# EAGLE schematic ThermocoupleBreakoutBoard (EAGLE 8.0.1)
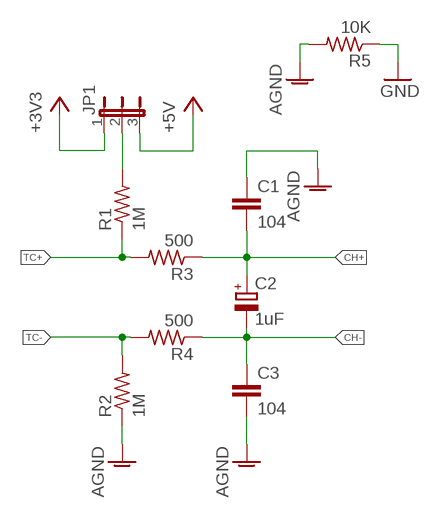
[diagram p0: schematic, sheet 1]

## Parts
C1  104  C-EUC1206  [C1206]
C2  1uF  CPOL-EUE2.5-6  [E2,5-6]
C3  104  C-EUC1206  [C1206]
JP1  JP2E  [JP2]
R1  1M  R-US_M1206  [M1206]
R2  1M  R-US_M1206  [M1206]
R3  500  R-US_M1206  [M1206]
R4  500  R-US_M1206  [M1206]
R5  10K  R-US_M1206  [M1206]

## Nets
+3V3: JP1.1
+5V: JP1.3
AGND: C1.1 C3.2 R2.1 R5.2
CH+: C1.2 C2.+ R3.1
CH-: C2.- C3.1 R4.1
GND: R5.1
N$5: JP1.2 R1.2
TC+: R1.1 R3.2
TC-: R2.2 R4.2

## Library data of the parts
C1 C3 = rcl_vm:C-EU: CAPACITOR, European symbol
C2 = rcl_vm:CPOL-EU: POLARIZED CAPACITOR, European symbol
JP1 = jumper_vm:JP2E: JUMPER
R1-R5 = rcl_vm:R-US_: RESISTOR, American symbol